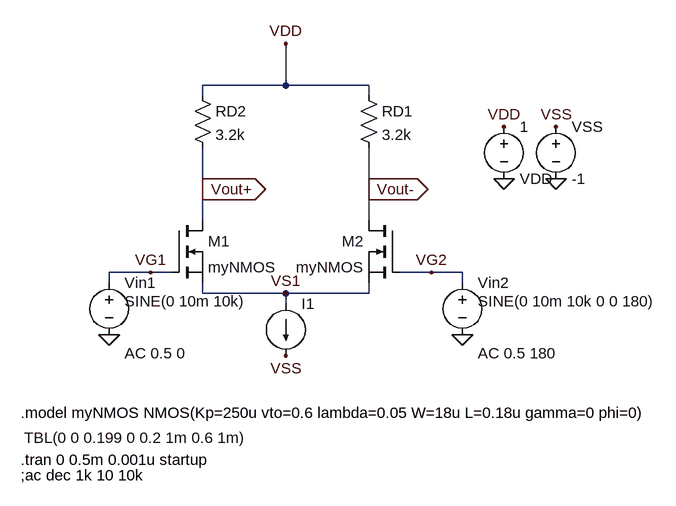
[diagram p0: schematic Project_part1.asc]
Project_part1.asc, the LTspice schematic file:
Version 4
SHEET 1 1524 800
WIRE 176 48 176 -16
WIRE 176 48 48 48
WIRE 304 48 176 48
WIRE 48 64 48 48
WIRE 304 64 304 48
WIRE 48 208 48 144
WIRE 304 208 304 144
WIRE 48 256 48 208
WIRE 304 256 304 208
WIRE -32 336 -96 336
WIRE 0 336 -32 336
WIRE 400 336 352 336
WIRE 448 336 400 336
WIRE -96 352 -96 336
WIRE 448 352 448 336
WIRE 48 368 48 352
WIRE 176 368 48 368
WIRE 304 368 304 352
WIRE 304 368 176 368
WIRE 176 384 176 368
FLAG 512 192 0
FLAG 592 192 0
FLAG -96 432 0
FLAG 448 432 0
FLAG 48 208 Vout+
IOPIN 48 208 Out
FLAG 304 208 Vout-
IOPIN 304 208 Out
FLAG -32 336 VG1
FLAG 400 336 VG2
FLAG 176 368 VS1
FLAG 592 112 VSS
FLAG 176 464 VSS
FLAG 512 112 VDD
FLAG 176 -16 VDD
SYMBOL nmos 352 256 M0
SYMATTR InstName M2
SYMATTR Value myNMOS
SYMBOL nmos 0 256 R0
SYMATTR InstName M1
SYMATTR Value myNMOS
SYMBOL voltage 512 96 R0
WINDOW 0 24 96 Left 2
WINDOW 3 24 16 Left 2
WINDOW 123 0 0 Left 0
WINDOW 39 0 0 Left 0
SYMATTR InstName VDD
SYMATTR Value 1
SYMBOL current 176 384 R0
WINDOW 123 0 0 Left 0
WINDOW 39 0 0 Left 0
WINDOW 3 -403 206 Left 2
SYMATTR Value TBL(0 0 0.199 0 0.2 1m 0.6 1m)
SYMATTR InstName I1
SYMBOL voltage 592 96 R0
WINDOW 123 0 0 Left 0
WINDOW 39 0 0 Left 0
SYMATTR InstName VSS
SYMATTR Value -1
SYMBOL voltage -96 336 R0
WINDOW 123 24 124 Left 2
WINDOW 39 0 0 Left 0
WINDOW 3 24 44 Left 2
SYMATTR Value2 AC 0.5 0
SYMATTR Value SINE(0 10m 10k)
SYMATTR InstName Vin1
SYMBOL voltage 448 336 R0
WINDOW 123 24 124 Left 2
WINDOW 39 0 0 Left 0
WINDOW 3 24 44 Left 2
SYMATTR Value2 AC 0.5 180
SYMATTR Value SINE(0 10m 10k 0 0 180)
SYMATTR InstName Vin2
SYMBOL res 32 48 R0
SYMATTR InstName RD2
SYMATTR Value 3.2k
SYMBOL res 288 48 R0
SYMATTR InstName RD1
SYMATTR Value 3.2k
TEXT -232 552 Left 2 !.model myNMOS NMOS(Kp=250u vto=0.6 lambda=0.05 W=18u L=0.18u gamma=0 phi=0)
TEXT -232 648 Left 2 !;ac dec 1k 10 10k
TEXT -232 624 Left 2 !.tran 0 0.5m 0.001u startup

The netlist it stands for:
* Project_part1.asc
M2 Vout- VG2 VS1 VS1 myNMOS
M1 Vout+ VG1 VS1 VS1 myNMOS
VDD VDD 0 1
I1 VS1 VSS TBL(0 0 0.199 0 0.2 1m 0.6 1m)
VSS VSS 0 -1
Vin1 VG1 0 SINE(0 10m 10k) AC 0.5 0
Vin2 VG2 0 SINE(0 10m 10k 0 0 180) AC 0.5 180
RD2 VDD Vout+ 3.2k
RD1 VDD Vout- 3.2k
.model NMOS NMOS
.model PMOS PMOS
.lib standard.mos
.model myNMOS NMOS(Kp=250u vto=0.6 lambda=0.05 W=18u L=0.18u gamma=0 phi=0)
;ac dec 1k 10 10k
.tran 0 0.5m 0.001u startup
.backanno
.end